# Altium schematic sheet main.SchDoc
size A2; Date: 06/28/25; ApprovedBy: x; SheetNumber: 1; SheetTotal: 3
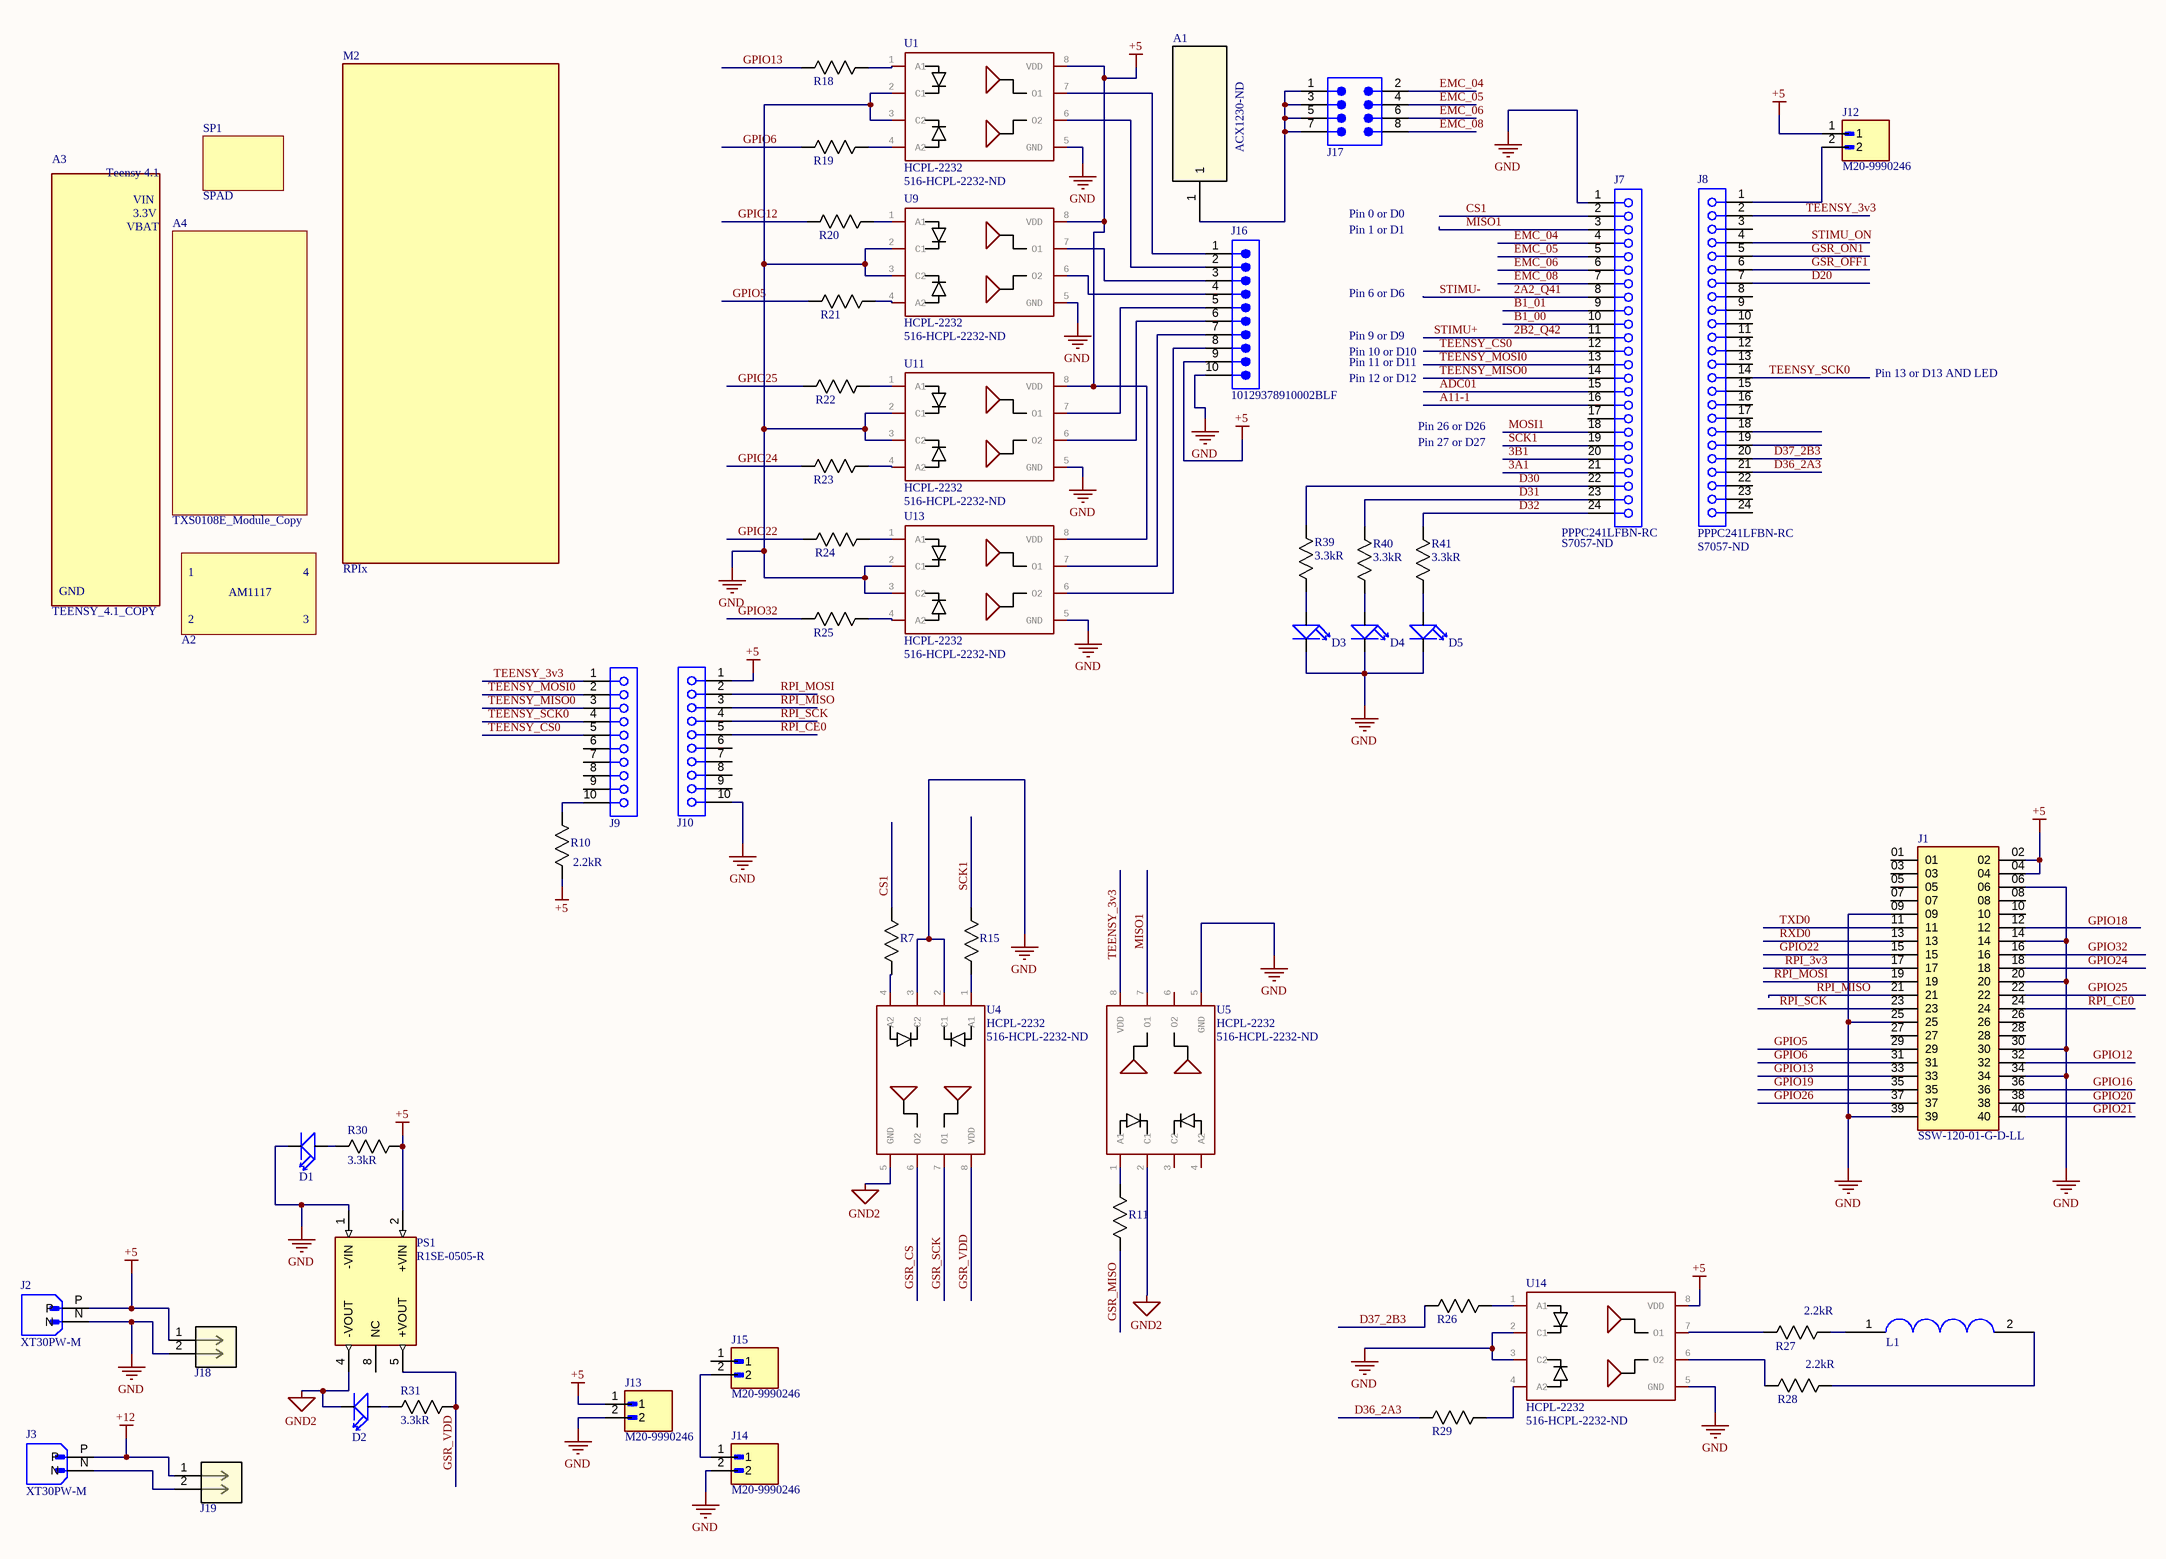
[diagram p0: main.SchDoc]

## Parts
A1  Supplier Part Number 1: ACX1230-ND  [SMA_VERTICAL]  (hidden comment: SMA_VERTICAL)
A2  AMS1117_BOARD_Copy  [AM117_BOARD_Copy]  (value not drawn)
A3  TEENSY_4.1_COPY  [TEENSY_LONG_EXT_COPY]
A4  TXS0108E_Module_Copy  [TXS0108E_Module_Copy]
D1  LED  [LEDM1608X80]  (value not drawn)
D2  LED  [LEDM1608X80]  (value not drawn)
D3  LED  [LEDM1608X80]  (value not drawn)
D4  LED  [LEDM1608X80]  (value not drawn)
D5  LED  [LEDM1608X80]  (value not drawn)
J1  SSW-120-01-G-D-LL  [SAMTEC_SSW-120-01-G-D-LL]
J2  XT30PW-M  [AMASS_XT30PW-M]
J3  XT30PW-M  [AMASS_XT30PW-M]
J7  PPPC241LFBN-RC  Supplier Part Number 1: S7057-ND  [HEADER_SOCKET_24]
J8  PPPC241LFBN-RC  Supplier Part Number 1: S7057-ND  [HEADER_SOCKET_24]
J9  PPTC101LFBN-RC  [HEADER_SOCKET_10]  (value not drawn)
J10  PPTC101LFBN-RC  [HEADER_SOCKET_10]  (value not drawn)
J12  M20-9990246  [HARWIN_M20-9990246]
J13  M20-9990246  [HARWIN_M20-9990246]
J14  M20-9990246  [HARWIN_M20-9990246]
J15  M20-9990246  [HARWIN_M20-9990246]
J16  10129378910002BLF  [HEADER_PIN_10]
J17  TSW-104-07-F-D  [HEADER_PIN_DOUBLE_8]  (value not drawn)
J18  B2P-VH  [CONN_B2P-VH_JST]  (value not drawn)
J19  B2P-VH  [CONN_B2P-VH_JST]  (value not drawn)
L1  COIL_PLANNER_A  [COIL_PLANNER_A]  (value not drawn)
M2  RPIx  [MODULE_RASPBERRY_PI_3_COPY]
PS1  R1SE-0505-R  [CONV_R1SE-0505-R]
R7  RMCF1206FT220R  [STA_RMCF1206_STP-L]  (value not drawn)
R10  Resistance: 2.2kR  [STA_RMCF1206_STP-L]  (hidden comment: CRGCQ1206F2K2)
R11  RMCF1206FT220R  [STA_RMCF1206_STP-L]  (value not drawn)
R15  RMCF1206FT220R  [STA_RMCF1206_STP-L]  (value not drawn)
R18  RMCF1206FT220R  [STA_RMCF1206_STP-L]  (value not drawn)
R19  RMCF1206FT220R  [STA_RMCF1206_STP-L]  (value not drawn)
R20  RMCF1206FT220R  [STA_RMCF1206_STP-L]  (value not drawn)
R21  RMCF1206FT220R  [STA_RMCF1206_STP-L]  (value not drawn)
R22  RMCF1206FT220R  [STA_RMCF1206_STP-L]  (value not drawn)
R23  RMCF1206FT220R  [STA_RMCF1206_STP-L]  (value not drawn)
R24  RMCF1206FT220R  [STA_RMCF1206_STP-L]  (value not drawn)
R25  RMCF1206FT220R  [STA_RMCF1206_STP-L]  (value not drawn)
R26  RMCF1206FT220R  [STA_RMCF1206_STP-L]  (value not drawn)
R27  Resistance: 2.2kR  [STA_RMCF1206_STP-L]  (hidden comment: CRGCQ1206F2K2)
R28  Resistance: 2.2kR  [STA_RMCF1206_STP-L]  (hidden comment: CRGCQ1206F2K2)
R29  RMCF1206FT220R  [STA_RMCF1206_STP-L]  (value not drawn)
R30  Resistance: 3.3kR  [STA_RMCF1206_STP-L]  (hidden comment: CRG1206F3K3)
R31  Resistance: 3.3kR  [STA_RMCF1206_STP-L]  (hidden comment: CRG1206F3K3)
R39  Resistance: 3.3kR  [STA_RMCF1206_STP-L]  (hidden comment: CRG1206F3K3)
R40  Resistance: 3.3kR  [STA_RMCF1206_STP-L]  (hidden comment: CRG1206F3K3)
R41  Resistance: 3.3kR  [STA_RMCF1206_STP-L]  (hidden comment: CRG1206F3K3)
SP1  SPAD  [SPAD]
U1  HCPL-2232  Supplier Part Number 1: 516-HCPL-2232-ND  [DIL08]
U4  HCPL-2232  Supplier Part Number 1: 516-HCPL-2232-ND  [DIL08]
U5  HCPL-2232  Supplier Part Number 1: 516-HCPL-2232-ND  [DIL08]
U9  HCPL-2232  Supplier Part Number 1: 516-HCPL-2232-ND  [DIL08]
U11  HCPL-2232  Supplier Part Number 1: 516-HCPL-2232-ND  [DIL08]
U13  HCPL-2232  Supplier Part Number 1: 516-HCPL-2232-ND  [DIL08]
U14  HCPL-2232  Supplier Part Number 1: 516-HCPL-2232-ND  [DIL08]

## Nets
+5: J1.02 J1.04 J2.P J10.1 J12.1 J13.1 J16.9 J18.1 PS1.2(+VIN) R10.1 R30.2 U1.8(VDD) U9.8(VDD) U11.8(VDD) U13.8(VDD) U14.8(VDD)
+12: J3.P J19.1
GND: D1.C D3.C D4.C D5.C J1.06 J1.09 J1.14 J1.20 J1.25 J1.30 J1.34 J1.39 J2.N J7.1 J10.10 J13.2 J14.2 J16.10 J18.2 PS1.1(-VIN) U1.2(C1) U1.3(C2) U1.5(GND) U4.2(C1) U4.3(C2) U5.5(GND) U9.2(C1) U9.3(C2) U9.5(GND) U11.2(C1) U11.3(C2) U11.5(GND) U13.2(C1) U13.3(C2) U13.5(GND) U14.2(C1) U14.3(C2) U14.5(GND)
GND2: D2.C PS1.4(-VOUT) U4.5(GND) U5.2(C1)
2A2_Q41: J7.8  [also labelled STIMU-]
2B2_Q42: J7.11  [also labelled STIMU+]
3A1: J7.21
3B1: J7.20
A11-1: J7.16
ADC01: J7.15
B1_00: J7.10
B1_01: J7.9
CS1: J7.2 R7.2
D20: J8.7
D30: J7.22 R39.2
D31: J7.23 R40.2
D32: J7.24 R41.2
D36_2A3: J8.21 R29.2
D37_2B3: J8.20 R26.2
EMC_04: J7.4 J17.2
EMC_05: J7.5 J17.4
EMC_06: J7.6 J17.6
EMC_08: J7.7 J17.8
GPIO5: J1.29 R21.2
GPIO6: J1.31 R19.2
GPIO12: J1.32 R20.2
GPIO13: J1.33 R18.2
GPIO16: J1.36
GPIO19: J1.35
GPIO21: J1.40
GPIO22: J1.15 R24.2
GPIO24: J1.18 R23.2
GPIO25: J1.22 R22.2
GPIO26: J1.37
GPIO32: J1.16 R25.2
GSR_CS: U4.6(O2)
GSR_MISO: R11.1
GSR_OFF1: J8.6
GSR_ON1: J8.5
GSR_SCK: U4.7(O1)
GSR_VDD: PS1.5(+VOUT) R31.2 U4.8(VDD)
MISO1: J7.3 U5.7(O1)
MOSI1: J7.18
RPI_3v3: J1.17
RPI_CE0: J1.24 J10.5
RPI_MISO: J1.21 J10.3
RPI_MOSI: J1.19 J10.2
RPI_SCK: J1.23 J10.4
RXD0: J1.13
SCK1: J7.19 R15.2
STIMU_ON: J8.4
TEENSY_3v3: J8.2 J9.1 U5.8(VDD)
TEENSY_CS0: J7.12 J9.5
TEENSY_MISO0: J7.14 J9.3
TEENSY_MOSI0: J7.13 J9.2
TEENSY_SCK0: J8.14 J9.4
TXD0: J1.11
NetA1_1: A1.1 J17.1 J17.3 J17.5 J17.7
NetD1_A: D1.A R30.1
NetD2_A: D2.A R31.1
NetD3_A: D3.A R39.1
NetD4_A: D4.A R40.1
NetD5_A: D5.A R41.1
NetJ3_N: J3.N J19.2
NetJ8_1: J8.1 J12.2
NetJ9_10: J9.10 R10.2
NetJ14_1: J14.1 J15.2
NetJ16_1: J16.1 U1.7(O1)
NetJ16_2: J16.2 U1.6(O2)
NetJ16_3: J16.3 U9.7(O1)
NetJ16_4: J16.4 U9.6(O2)
NetJ16_5: J16.5 U11.7(O1)
NetJ16_6: J16.6 U11.6(O2)
NetJ16_7: J16.7 U13.7(O1)
NetJ16_8: J16.8 U13.6(O2)
NetL1_1: L1.1 R27.2
NetL1_2: L1.2 R28.2
NetR7_1: R7.1 U4.4(A2)
NetR11_2: R11.2 U5.1(A1)
NetR15_1: R15.1 U4.1(A1)
NetR18_1: R18.1 U1.1(A1)
NetR19_1: R19.1 U1.4(A2)
NetR20_1: R20.1 U9.1(A1)
NetR21_1: R21.1 U9.4(A2)
NetR22_1: R22.1 U11.1(A1)
NetR23_1: R23.1 U11.4(A2)
NetR24_1: R24.1 U13.1(A1)
NetR25_1: R25.1 U13.4(A2)
NetR26_1: R26.1 U14.1(A1)
NetR27_1: R27.1 U14.7(O1)
NetR28_1: R28.1 U14.6(O2)
NetR29_1: R29.1 U14.4(A2)

Not connected (* = marked no-connect by the designer): J1 01 03 05 07 08 10 12 26 27 28 38; J7 17; J8 3 8 9 10 11 12 13 15 16 17 18 19 22 23 24; J9 6 7 8 9; J10 6 7 8 9; J15 1; PS1 8(NC); U5 3(C2) 4(A2) 6(O2)

## Notes on the sheet
- Pin 0 or D0
- Pin 1 or D1
- Pin 6 or D6
- Pin 9 or D9
- Pin 10 or D10
- Pin 11 or D11
- Pin 12 or D12
- Pin 13 or D13 AND LED
- Pin 26 or D26
- Pin 27 or D27
- Labels drawn without touching a wire or pin: GPIO18, GPIO20
- THIS DOCUMENT AND THE DATA DISCLOSED HEREIN OR
- HEREWITH IS THE PROPERTY OF ALTIUM LIMITED AND MAY
- DWG NO:
- REVISION
- REV:
- DESCRIPTION
- DATE
- APPROVED
- BE FREELY DISTRIBUTED IN WHOLE. NO RIGHTS ARE
- RESERVED OR EXPRESS OR IMPLIED WARANTEE GIVEN.
- ENG:
- APPROVALS
- PROJECT
- DSN:
- CHK:
- REFERENCE DOCUMENTS
- PROJECT REVISION:
- TITLE
- DOCUMENT REVISION:
- DESIGN ITEM:
- BOM:
- FAB DWG:
- PCB DWG:
- ASSY DWG:
- SCALE:
- A3
- SIZE
- CAGE CODE
- FILE NAME
- DWG NO.
- SHEET
- OF
- REV
- (in symbol AMS1117_BOARD_Copy) 1; 4; AM1117; 2; 3
- (in symbol TEENSY_4.1_COPY) VIN; 3.3V; VBAT; GND

## Library data of the parts
A1 = SMA_VERTICAL: connector, rf coaxial, sma str jack for p.c.board, 4 legs, .050 center cont, 50 ohm; Manufacturer: Amphenol Connex; Manufacturer Part Number: 132134; Number of Contacts: 1NUMBER; Supplier 1: Digikey; RoHS: Yes; Category: RF / Coaxial Connectors; Stock 1: 8757; Pricing 1: 1=5.97, 10=5.52, 25=5.362, 50=4.965, 100=4.5941, 300=4.48817, 500=3.66732, 2500=3.43802 (USD); Lead Free: 5697LeadFree; ComponentLink1URL: https://datasheet.ciiva.com/644/132134-644417.pdf?src-supplier=Digikey; ComponentLink1Description: https://datasheet.ciiva.com/644/132134-644417.pdf?src-supplier=Digikey; ComponentLink2URL: https://datasheet.ciiva.com/1118/132134-customer-drawing-1118290.pdf?src-supplier=Newark; ComponentLink2Description: https://datasheet.ciiva.com/1118/132134-customer-drawing-1118290.pdf?src-supplier=Newark; ComponentLink3URL: https://datasheet.ciiva.com/24472/132134-24472891.pdf?src-supplier=Onlinecomponents.com; ComponentLink3Description: https://datasheet.ciiva.com/24472/132134-24472891.pdf?src-supplier=Onlinecomponents.com; ComponentLink4URL: https://datasheet.ciiva.com/8045/1510247-8045022.pdf?src-supplier=Element14; ComponentLink4Description: https://datasheet.ciiva.com/8045/1510247-8045022.pdf?src-supplier=Element14; ComponentLink5URL: https://datasheet.ciiva.com/1116/1510247-1116395.pdf?src-supplier=Element14; ComponentLink5Description: https://datasheet.ciiva.com/1116/1510247-1116395.pdf?src-supplier=Element14; ComponentLink6URL: https://datasheet.ciiva.com/14568/70031837-14568710.pdf?src-supplier=Allied+Electronics; ComponentLink6Description: https://datasheet.ciiva.com/14568/70031837-14568710.pdf?src-supplier=Allied+Electronics
A3 = TEENSY_4.1_COPY: Teensy 4.1 with VBAT <br> <a href="https://www.pjrc.com/store/teensy41.html#pins">Datasheet</a> <br> Requires ordering of: <ul> <li>2: 24 pin, 0.1" pitch female headers</li> <li>1:  2 pin, 0.1" pitch female headers</li> </ul>; MF: PJRC; SnapEDA_Link: https://www.snapeda.com/parts/Teensy%204.1/PJRC/view-part/?ref=snap; Package: None; Value: *; MP: Teensy 4.1; Check_prices: https://www.snapeda.com/parts/Teensy%204.1/PJRC/view-part/?ref=eda
D1-D5 = LTST-C190KFKT_1: Single Color LED, Ultra Bright Orange, Water Clear, 1.1mm; Manufacturer: Vishay Lite-On; Lens Color: Colorless; Power Rating: 75mW; Luminous Intensity: 90mcd; Viewing Angle: 130°; Forward Current: 30mA; Forward Voltage: 2V; Lens Style: Flat,Diffused,Colorless,Rectangular,Clear; Dominant Wavelength: 605nm; Test Current: 20mA; Number of Elements: 1; Reverse Voltage: 5V; Voltage Rating: 50V; Resistance: 47kR; Tolerance: 1%; Lens Size: 0.8mm; Supplier 1: Digikey; Manufacturer Part Number: LTST-C190KFKT; RoHS: Yes; Category: LEDs; Stock 1: 96032; Pricing 1: 1=0.13, 10=0.089, 100=0.0613, 500=0.0484, 1000=0.0441, 2000=0.04042 (USD); Mount: Surface Mount; Case/Package: 0603; Number of Pins: 2; Color: Orange; Case Code (Metric): 1608; Case Code (Imperial): 0603; Min Operating Temperature: -55°C; Max Operating Temperature: 85°C; Packaging: Tape and Reel; Package Quantity: 3000; Illumination Color: Orange; Lens Transparency: Clear; Power Dissipation: 75mW; Wavelength: 605nm; Number of LEDs: 1; Series: -; Voltage Rating (DC): 50V; Length: 3.2mm; Width: 0.8mm; Height: 0.9mm; Depth: 1.6mm; Radiation Hardening: No; Lead Free: Lead Free; RoHS Compliant: Yes; Reach SVHC Compliant: 4186SVHC; ComponentLink1URL: https://datasheet.ciiva.com/11774/0900766b80dc02a7-11774744.pdf?src-supplier=Rs; ComponentLink1Description: https://datasheet.ciiva.com/11774/0900766b80dc02a7-11774744.pdf?src-supplier=Rs; ComponentLink2URL: https://datasheet.ciiva.com/15201/getdatasheetpartid-309341-15201388.pdf?src-supplier=Verical; ComponentLink2Description: https://datasheet.ciiva.com/15201/getdatasheetpartid-309341-15201388.pdf?src-supplier=Verical; ComponentLink3URL: https://datasheet.ciiva.com/16396/lite-on20ltst-c190kfkt-16396246.pdf?src-supplier=Future+Electronics; ComponentLink3Description: https://datasheet.ciiva.com/16396/lite-on20ltst-c190kfkt-16396246.pdf?src-supplier=Future+Electronics; ComponentLink4URL: https://datasheet.ciiva.com/12400/100-ltst-c190kfkt-53640-12400769.pdf?src-supplier=Mouser; ComponentLink4Description: https://datasheet.ciiva.com/12400/100-ltst-c190kfkt-53640-12400769.pdf?src-supplier=Mouser; ComponentLink5URL: https://datasheet.ciiva.com/2109/s-110-ltst-c190kfkt-2109976.pdf?src-supplier=Digikey; ComponentLink5Description: https://datasheet.ciiva.com/2109/s-110-ltst-c190kfkt-2109976.pdf?src-supplier=Digikey; ComponentLink6URL: https://datasheet.ciiva.com/2109/s-110-ltst-c190kfkt-2109977.pdf?src-supplier=Digikey; ComponentLink6Description: https://datasheet.ciiva.com/2109/s-110-ltst-c190kfkt-2109977.pdf?src-supplier=Digikey; ComponentLink7URL: https://datasheet.ciiva.com/2109/s-110-ltst-c190kfkt-2109978.pdf?src-supplier=Digikey; ComponentLink7Description: https://datasheet.ciiva.com/2109/s-110-ltst-c190kfkt-2109978.pdf?src-supplier=Digikey; Supplier Part Number 1: 160-1434-1-ND
J1 = SSW-120-01-G-D-LL: MF: Samtec Inc.; Value: *; Package: None; Price: None; Availability: Unavailable; MP: SSW-120-01-G-D-LL; Supplier Part Number 1: SSW-120-01-G-D-LL-ND
J2 J3 = XT30PW-M: Socket; DC supply; XT30; male; PIN: 2; on PCBs; THT; Colour: yellow; MF: AMASS; SnapEDA_Link: https://www.snapeda.com/parts/XT30PW-M/AMASS/view-part/?ref=snap; Package: None; Value: *; MP: XT30PW-M; Check_prices: https://www.snapeda.com/parts/XT30PW-M/AMASS/view-part/?ref=eda; Supplier Part Number 1: C431092
J7 J8 = HEADER_SOCKET_24: Conn Hdr 24POS 0.1 Gold Pcb; Manufacturer: Sullins; Number of Positions: 24; Connector Type: Header; Voltage Rating: 250V; Supplier 1: Digikey; Manufacturer Part Number: PPPC241LFBN-RC; RoHS: Yes; Category: Connectors; Stock 1: 2439; Pricing 1: 1=1.35, 10=1.144, 100=0.972, 500=0.86756, 1000=0.82614, 5000=0.7631 (USD); Mount: Through Hole; Contact Material: Bronze; Housing Material: Plastic; Contact Finish - Mating: GOLD; Insulation Color: Black; Insulation Material: Polyester; Contact Shape: Square; Min Operating Temperature: -40°C; Max Operating Temperature: 105°C; Series: -; Number of Rows: 1; Packaging: Tray; Termination: Solder; Contact Type: Female Socket; Fastening Type: Pull; Length: 61.5mm; Width: 2.5mm; Height: 8.5mm; Lead Free: Lead Free; RoHS Compliant: Yes; Flammability Rating: UL94 V-0; ComponentLink1URL: https://media.digikey.com/pdf/Data%20Sheets/Sullins%20PDFs/Female_Headers.100_DS.pdf?src-supplier=Digikey; ComponentLink1Description: https://media.digikey.com/pdf/Data%20Sheets/Sullins%20PDFs/Female_Headers.100_DS.pdf?src-supplier=Digikey; ComponentLink2URL: https://datasheet.octopart.com/PPPC241LFBN-RC-Sullins-datasheet-145015166.pdf?src-supplier=Future+Electronics; ComponentLink2Description: https://datasheet.octopart.com/PPPC241LFBN-RC-Sullins-datasheet-145015166.pdf?src-supplier=Future+Electronics
J9 J10 = HEADER_SOCKET_10: 10 Position Single Row 2.54 mm Pitch Vertical Through Hole Socket Header; Manufacturer: Sullins; Number of Positions: 10; Voltage Rating: 250V; Supplier 1: Digikey; Manufacturer Part Number: PPTC101LFBN-RC; RoHS: Yes; Category: Connectors; Stock 1: 12734; Pricing 1: 1=0.56, 10=0.479, 320=0.37469, 640=0.35678, 1280=0.33974, 5120=0.30808, 10240=0.29429 (USD); Mount: Through Hole; Contact Material: Bronze; Housing Material: Plastic; Contact Finish - Mating: TIN; Insulation Color: Black; Insulation Material: Polyester; Contact Shape: Square; Min Operating Temperature: -40°C; Max Operating Temperature: 105°C; Series: -; Number of Rows: 1; Packaging: Tray; Termination: Solder; Connector Type: Header; Contact Type: Female Socket; Fastening Type: Pull; Length: 25.9mm; Width: 2.5mm; Height: 8.5mm; Lead Free: Lead Free; RoHS Compliant: Yes; Flammability Rating: UL94 V-0; ComponentLink1URL: https://media.digikey.com/pdf/Data%20Sheets/Sullins%20PDFs/Female_Headers.100_DS.pdf?src-supplier=Digikey; ComponentLink1Description: https://media.digikey.com/pdf/Data%20Sheets/Sullins%20PDFs/Female_Headers.100_DS.pdf?src-supplier=Digikey; Supplier Part Number 1: S7008-ND
J12-J15 = M20-9990246: 2.54mm (0.1) Pitch SIL Vertical Throughboard Pin Header, 6.1mm mating pin height, tin, 2 contacts; MF: Harwin; SnapEDA_Link: https://www.snapeda.com/parts/M20-9990246/Harwin/view-part/?ref=snap; Package: None; Value: *; MP: M20-9990246; Check_prices: https://www.snapeda.com/parts/M20-9990246/Harwin/view-part/?ref=eda; Supplier Part Number 1: 952-2262-ND
J16 = HEADER_PIN_10: Header Sr Vt Th 1X10-10129378-910002BLF; Manufacturer: Amphenol ICC / FCI; Supplier 1: Digikey; Manufacturer Part Number: 10129378910002BLF; RoHS: No; Stock 1: 16991; Pricing 1: 1=0.19, 10=0.164, 100=0.1394, 500=0.12438, 2400=0.11133, 7200=0.10302, 12000=0.09937 (USD); ComponentLink1URL: https://datasheet.octopart.com/10129378-910002BLF-Amphenol-ICC-datasheet-100454231.pdf?src-supplier=Newark; ComponentLink1Description: https://datasheet.octopart.com/10129378-910002BLF-Amphenol-ICC-datasheet-100454231.pdf?src-supplier=Newark; Supplier Part Number 1: 10129378-910002BLF-ND
J17 = HEADER_PIN_DOUBLE_8: Connector, Header, 8Pos, 2Row, 2.54Mm Rohs Compliant: Yes; Manufacturer: Samtec; Max Current Rating: 7.6A; Number of Positions: 8; Max Voltage Rating (AC): 550V; Gender: Male; Row Spacing: 0.1inch; Supplier 1: Digikey; Manufacturer Part Number: TSW-104-07-F-D; RoHS: Yes; Category: Connectors; Stock 1: 10136; Pricing 1: 1=0.43, 50=0.37, 100=0.31, 500=0.26, 1000=0.22, 2000=0.19, 5000=0.17, 10000=0.15 (USD); Mount: Through Hole; Color: Black; Contact Plating: Gold; Contact Material: Bronze; Housing Color: Black; Housing Material: Polyester; Min Operating Temperature: -55°C; Max Operating Temperature: 125°C; Package Quantity: 1; Number of Rows: 2; Packaging: Rail/Tube; Termination: Solder; Number of Contacts: 8; Orientation: Straight; Series: TSW; Contact Type: Male Pin; Length: 10.16mm; Pitch: 2.54mm; Contact Mating Length: 0.23inch; Depth: 5.08mm; Radiation Hardening: No; Reach SVHC Compliant: No; RoHS Compliant: Yes; ComponentLink1URL: https://datasheet.ciiva.com/739/tsw-xxx-xx-xxx-x-xx-xxx-mkt-739906.pdf?src-supplier=Digikey; ComponentLink1Description: https://datasheet.ciiva.com/739/tsw-xxx-xx-xxx-x-xx-xxx-mkt-739906.pdf?src-supplier=Digikey; Supplier Part Number 1: SAM8996-ND
J18 J19 = B2P-VH: VH Non-RoHS Compliant 2003 Vertical Connector Header -25C~85C 10A 250V 0.303 7.70mm; Manufacturer: JST; Number of Positions: 2; Gender: Male; Pitch: 0.156inch; Supplier 1: Digikey; Manufacturer Part Number: B2P-VH; RoHS: Yes; Category: Headers and Wire Housings; Stock 1: 15152; Pricing 1: 1=0.13, 10=0.112, 100=0.0949, 500=0.08472, 1000=0.08068, 5000=0.07201, 10000=0.06857 (USD); Mount: Through Hole; Contact Plating: Tin,Lead; Housing Color: Natural; Contact Material: Brass; Housing Material: Nylon; Color: Natural; Fastening Type: Friction; Packaging: Bulk; Number of Rows: 1; Termination: Solder; Orientation: Vertical; Number of Contacts: 2; Series: VH; Contact Type: Male Pin; Package Quantity: 1000; Contact Mating Length: 0.303inch; Lead Free: Contains Lead; ComponentLink1URL: https://datasheet.ciiva.com/6892/vhseries-6892089.pdf?src-supplier=Digikey; ComponentLink1Description: https://datasheet.ciiva.com/6892/vhseries-6892089.pdf?src-supplier=Digikey; Supplier Part Number 1: 455-1639-ND
M2 = RPIx_Copy
PS1 = R1SE-0505-R: 1W DC/DC-Converter 'ECONOLINE' SMD 1kV unreg; MF: Recom Power; SnapEDA_Link: https://www.snapeda.com/parts/R1SE-0505-R/Recom+Power/view-part/?ref=snap; Package: None; Value: *; MP: R1SE-0505-R; Check_prices: https://www.snapeda.com/parts/R1SE-0505-R/Recom+Power/view-part/?ref=eda; Supplier Part Number 1: 945-1659-2-ND
R7 R11 R15 R18-R26 R29 = RMCF1206FT220R: No Description Available; Manufacturer_Name: Stackpole International; Copyright: Copyright (C) 2025 Ultra Librarian. All rights reserved.; Manufacturer_Part_Number: RMCF1206FT220R; Supplier Part Number 1: RMCF1206FT220RTR-ND
R10 R27 R28 = R1206F2K2: SMD Chip Resistor, 2.2 kOhm, ± 1%, 250 mW, 1206 [3216 Metric], Thick Film, General Purpose; Manufacturer: TE Connectivity; Power Rating: 250mW; Temperature Coefficient: 100ppm/°C; Voltage Rating: 200V; Supplier 1: Digikey; Manufacturer Part Number: CRGCQ1206F2K2; RoHS: Yes; Category: Chip SMD Resistors; Stock 1: 205224; Pricing 1: 1=0.1, 10=0.046, 100=0.0242, 1000=0.01451, 2500=0.01234 (USD); Case/Package: 1206; Min Operating Temperature: -55°C; Max Operating Temperature: 155°C; Packaging: Cut Tape; Voltage Rating (DC): 200V; Operating Supply Voltage: 200V; Height: 650um; RoHS Compliant: Yes; ComponentLink1URL: https://www.te.com/commerce/DocumentDelivery/DDEController?Action=srchrtrv&DocNm=1773204-3&DocType=DS&DocLang=English&src-supplier=Digikey; ComponentLink1Description: https://www.te.com/commerce/DocumentDelivery/DDEController?Action=srchrtrv&DocNm=1773204-3&DocType=DS&DocLang=English&src-supplier=Digikey; ComponentLink2URL: https://www.te.com/commerce/DocumentDelivery/DDEController?Action=srchrtrv&amp;DocNm=1773204-3&amp;DocType=DS&amp;DocLang=English&src-supplier=Digikey; ComponentLink2Description: https://www.te.com/commerce/DocumentDelivery/DDEController?Action=srchrtrv&amp;DocNm=1773204-3&amp;DocType=DS&amp;DocLang=English&src-supplier=Digikey; ComponentLink3URL: https://datasheet.octopart.com/CRGCQ1206F2K2-TE-Connectivity-datasheet-114679081.pdf?src-supplier=Master+Electronics; ComponentLink3Description: https://datasheet.octopart.com/CRGCQ1206F2K2-TE-Connectivity-datasheet-114679081.pdf?src-supplier=Master+Electronics; Supplier Part Number 1: A129814CT-ND
R30 R31 R39-R41 = R3K3_1206: Res Thick Film 1206 3.3K Ohm 1% 0.25W(1/4W) ±100ppm/C Pad SMD T/R; Manufacturer: TE Connectivity; Power Rating: 250mW; Voltage Rating: 200V; Temperature Coefficient: 100ppm/°C; Number of Resistors: 1; Supplier 1: Digikey; Manufacturer Part Number: CRG1206F3K3; RoHS: Yes; Category: Chip SMD Resistors; Stock 1: 5858; Pricing 1: 1=0.1, 10=0.045, 100=0.0236, 1000=0.01376, 2500=0.01198 (USD); Mount: Surface Mount; Case/Package: 1206; Number of Pins: 1206; Case Code (Imperial): 1206; Case Code (Metric): 3216; Weight: 0.000571oz; Min Operating Temperature: -55°C; Max Operating Temperature: 125°C; Tolerance: 1%; Packaging: Tape and Reel; Resistor Type: Thick Film; Package Quantity: 5000; Termination: Solder; Number of Terminations: 2; Series: CRG, Neohm; Max Power Dissipation: 250mW; Technology: THICK FILM; Operating Supply Voltage: 200V; Length: 3.1mm; Width: 1.55mm; Height: 0.55mm; Depth: 1.55mm; Radiation Hardening: No; RoHS Compliant: Yes; ComponentLink1URL: https://datasheet.ciiva.com/11809/0900766b800a696e-11809587.pdf?src-supplier=Rs; ComponentLink1Description: https://datasheet.ciiva.com/11809/0900766b800a696e-11809587.pdf?src-supplier=Rs; ComponentLink2URL: https://datasheet.ciiva.com/30098/eng-ds-1773204-e-30098265.pdf?src-supplier=Onlinecomponents.com; ComponentLink2Description: https://datasheet.ciiva.com/30098/eng-ds-1773204-e-30098265.pdf?src-supplier=Onlinecomponents.com; ComponentLink3URL: https://datasheet.ciiva.com/5562/eng-ds-1773204-g-5562583.pdf?src-supplier=Mouser; ComponentLink3Description: https://datasheet.ciiva.com/5562/eng-ds-1773204-g-5562583.pdf?src-supplier=Mouser; ComponentLink4URL: https://datasheet.ciiva.com/16779/70063020-16779767.pdf?src-supplier=Allied+Electronics; ComponentLink4Description: https://datasheet.ciiva.com/16779/70063020-16779767.pdf?src-supplier=Allied+Electronics; Supplier Part Number 1: A106076CT-ND
U1 U4 U5 U9 U11 U13 U14 = HCPL-2232: Optocoupler Logic Output Totem-Pole DC Input 2 Channel 8-Pin Plastic Dip Tube; Manufacturer: Broadcom Avago; Rise Time: 30ns; Number of Channels: 2; Output Current per Channel: 25mA; Isolation Voltage: 3.75kV; Data Rate: 5Mbps; Max Power Dissipation: 294mW; Propagation Delay: 300ns; Direction: Unidirectional; Forward Current: 10mA; Forward Voltage: 1.7V; Reverse Breakdown Voltage: 5V; Fall Time: 0.007us; Output Type: TOTEM POLE; Input Current: 1.8mA; Polarity: Non-Inverting; Supplier 1: Digikey; Manufacturer Part Number: HCPL-2232; RoHS: No; Category: Optocouplers; Stock 1: 448; Pricing 1: 1=14.3, 50=9.7886, 100=9.3402, 500=8.54718, 1000=8.29007 (USD); Mount: Through Hole; Case/Package: DIP; Number of Pins: 8; Min Operating Temperature: -40°C; Max Operating Temperature: 85°C; Packaging: Rail/Tube; Output Current: 25mA; Package Quantity: 50; Turn-On Delay Time: 300ns; Number of Elements: 2; Power Dissipation: 294mW; Series: -; Input Type: DC; Max Output Current: 25mA; Length: 9.65mm; Width: 6.35mm; Height: 3.56mm; Radiation Hardening: No; Lead Free: Contains Lead; RoHS Compliant: No; Reach SVHC Compliant: No; ComponentLink1URL: https://datasheet.ciiva.com/15119/getdatasheetpartid-112638-15119660.pdf?src-supplier=Verical; ComponentLink1Description: https://datasheet.ciiva.com/15119/getdatasheetpartid-112638-15119660.pdf?src-supplier=Verical; ComponentLink2URL: https://datasheet.ciiva.com/8065/310763-8065655.pdf?src-supplier=Element14; ComponentLink2Description: https://datasheet.ciiva.com/8065/310763-8065655.pdf?src-supplier=Element14